# EAGLE design wiiuusbc (EAGLE 9.6.2)
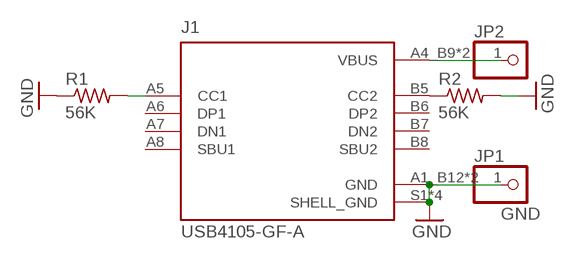
[diagram p0: schematic, sheet 1]

## Parts
J1  USB4105-GF-A  [GCT_USB4105-GF-A]
JP1  PINHD-1X1  [1X01]
JP2  PINHD-1X1  [1X01]
R1  56K  R-US_R0402  [R0402]
R2  56K  R-US_R0402  [R0402]

## Nets
CC1: J1.A5(CC1) R1.2
CC2: J1.B5(CC2) R2.1
GND: J1.A1_B12(GND) J1.B1_A12(GND) J1.S1(SHELL_GND) J1.S2(SHELL_GND) J1.S3(SHELL_GND) J1.S4(SHELL_GND) JP1.1 R1.1 R2.2
VCC: J1.A4_B9(VBUS) J1.B4_A9(VBUS) JP2.1
Unconnected: J1.A6(DP1) J1.A7(DN1) J1.A8(SBU1) J1.B6(DP2) J1.B7(DN2) J1.B8(SBU2)

## Library data of the parts
J1 = USB4105-GF-A:USB4105-GF-A: USB-C (USB TYPE-C) USB 2.0 Receptacle Connector 24 (16+8 Dummy) Position Surface Mount, Right Angle; Through Hole Check availability <https://pricing.snapeda.com/parts/USB4105-GF-A/GCT/view-part?ref=eda>; AVAILABILITY: In Stock; DESCRIPTION: USB-C (USB TYPE-C) USB 2.0 Receptacle Connector 24 (16+8 Dummy) Position Surface Mount, Right Angle; Through Hole; MF: GCT; MP: USB4105-GF-A; PACKAGE: None; PRICE: None; PURCHASE-URL: https://pricing.snapeda.com/search/part/USB4105-GF-A/?ref=eda
JP1 JP2 = better14pin:PINHD-1X1: Pin header 1x1 for 0.1" spacing With round pins
R1 R2 = adafruit:R-US_: RESISTOR, American symbol

## Board
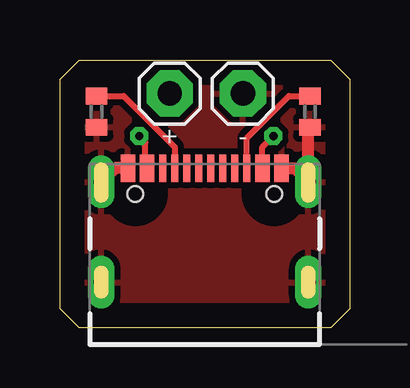
[diagram p1: board, top side]
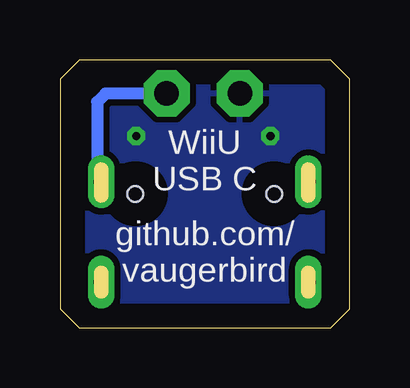
[diagram p2: board, bottom side, seen from below]

Size 12.06 x 11.18 mm. Coordinates in mm from the lower left corner, seen from the top.
Outline: 12.06,10.38 12.06,0.79 11.27,0 0.79,0 0,0.79 0,10.38 0.79,11.18 11.27,11.18 12.06,10.38
Copper layers (1*16): Top 0.035mm / dielectric 1.5mm / Bottom 0.035mm
Design rules "default": minimum track width 6mil, minimum drill 0.35mm, track to track 6mil, track to pad 6mil, pad to pad 6mil, via to via 6mil, smd to smd 6mil, copper to edge 40mil, drill to drill 6mil, minimum pad ring 10mil, minimum via ring 8mil, stop-mask expansion 4mil, vias tented up to drill 0mil, thermal gap 10mil

### Footprints (pad centres in the part's own frame; a part is rotated, then mirrored left to right if it is on the bottom)
GCT_USB4105-GF-A = smd 0.6 x 1.15: A1_B12 -3.2,4.755; A4_B9 -2.4,4.755; B1_A12 3.2,4.755; B4_A9 2.4,4.755 | smd 0.3 x 1.15: A5 -1.25,4.755; A6 -0.25,4.755; A7 0.25,4.755; A8 1.25,4.755; B5 1.75,4.755; B6 0.75,4.755; B7 -0.75,4.755; B8 -1.75,4.755 | drill 0.6 pad 1.05 long: S1 -4.32,4.18; S4 4.32,4.18 | drill 0.6 pad 1 long: S2 -4.32,0; S3 4.32,0 | hole 0.65: 2.89,3.68; -2.89,3.68
1X01 = drill 1.016 pad 1.93 octagon: 1 0,0
R0402 = smd 0.7 x 0.9: 1 -0.65,0; 2 0.65,0

### Placement (x,y rotation side)
J1  6.03,1.91 0 top
JP1  7.62,9.78 0 top
JP2  4.57,9.78 0 top
R1  1.52,9.02 90 top
R2  10.41,9.02 270 top

### Tracks (layer width: path | path; a pad name or v marks a point on that pad's centre or on a via)
CC1
  Top 0.254: R1.2 2.65,9.67 4.78,7.54 J1.A5
CC2
  Top 0.254: J1.B5 7.78,7.91 9.54,9.67 R2.1
GND  (1 unrouted)
  Top 0.508: J1.B1_A12 9.78,6.66 J1.S4 10.35,8.31 R2.2 | J1.A1_B12 2.29,6.66 J1.S1
  Bottom 0.508: JP1.1 10.16,9.78 10.52,9.42 10.52,6.08
  pour Top (isolate 0.254): 0,11.3 12.19,11.3 12.19,-0.13 0,-0.13
VCC  (via drill 0.35)
  Top 0.254: J1.A4_B9 3.56,6.74 3.56,7.75 v3.3,8 | J1.B4_A9 8.43,7.54 v8.89,8
  pour Bottom (isolate 0.254): 0,11.3 0,-0.13 12.19,-0.13 12.19,11.3

### Text on the board
tNames: + | -
bNames: WiiU / USB C | github.com/ / vaugerbird